# EasyEDA Pro project ProProject_扫描隧道显微镜OpenSTM_2023-08-25.epro, board Sample_ConnectBoard
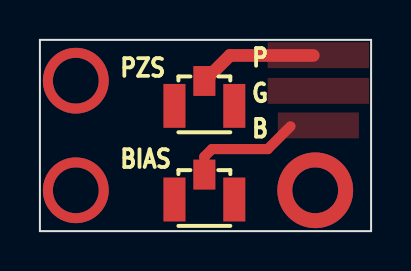
[diagram p12: board, top side]
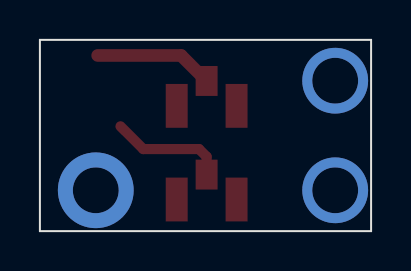
[diagram p13: board, bottom side, seen from below]

Outline 16.6 x 9.6 mm; copper layers: Top Layer, Bottom Layer. Coordinates in mm from the lower left corner of the outline.
Outline path: 0,9.6 0,0 16.6,0 16.6,9.6 0,9.6
Stack: Top Layer 0.035mm / Dielectric1 1.51mm FR4 er 4.5 / Bottom Layer 0.035mm

## Design rules (mm)
spacing safeClearance (default): track to track 0.152, other pairs 0.152 to 0.3
track width trackWidth (default): min 0.127, default 0.254, max 2.54
differential pair differentialPair (default): width min 0.127, default 0.254, max 2.54; gap min 0.152, default 0.152
via viaSize (default): diameter min 0.5, default 0.61, max 10; hole min 0.3, default 0.305, max 6

## Placement (name value [footprint] x y rotation side)
JP1  -  [ANT-SMD_UFL-R-SMT-1-10]  8.24 2.21 270 top
JP3  -  [ANT-SMD_UFL-R-SMT-1-10]  8.24 6.91 270 top

## Footprints (pads in the part's own frame, mm; a bottom-side part is the same pattern mirrored in y, then rotated)
ANT-SMD_UFL-R-SMT-1-10
  rect 2.2x1.1 smd: 1(0.625,1.5) 3(0.625,-1.5)
  rect 1.5x1.1 smd: 2(-0.625,0.001)

## Nets
As in the schematic.

## Via types
v1: diameter 3.3, hole 2.3, Top Layer to Bottom Layer, 2 vias
v2: diameter 3.8, hole 2.3, Top Layer to Bottom Layer, 1 via

## Routing (per net, layer and track width the routed paths; a pad name or vN(x,y) marks a point on that pad's centre or on a via; arc(x,y) is an arc through that point)
GND:
  vias: v1(1.8,7.55) v1(1.8,2.05) v2(13.8,2.05)
BIAS: length 5.8
  Top Layer w0.508: 12.56,5.26 11.42,4.12 8.62,4.12 8.24,3.74 JP1.2
PZS: length 6
  Top Layer w0.635: JP3.2 9.52,8.82 13.7,8.82

## Copper pours and planes (outline as drawn; the poured copper is in the pictures)
GND on Top Layer: -1.54,10.85 18.02,10.85 18.02,-0.96 -1.54,-0.96
GND on Top Layer: 11.42,7.69 16.5,7.69 16.5,6.39 11.42,6.39
GND on Bottom Layer: -1.79,11.23 18.4,11.23 18.4,-1.22 -1.79,-1.22
BIAS on Top Layer: 11.93,5.96 15.99,5.96 15.99,4.66 11.93,4.66
PZS on Top Layer: 11.42,9.48 16.5,9.48 16.5,8.18 11.42,8.18

## Text on the board
Top Silkscreen Layer: BIAS | PZS | P | G | B
